# EAGLE schematic interconnect_RSS_V1.0 (EAGLE 9.3.0)
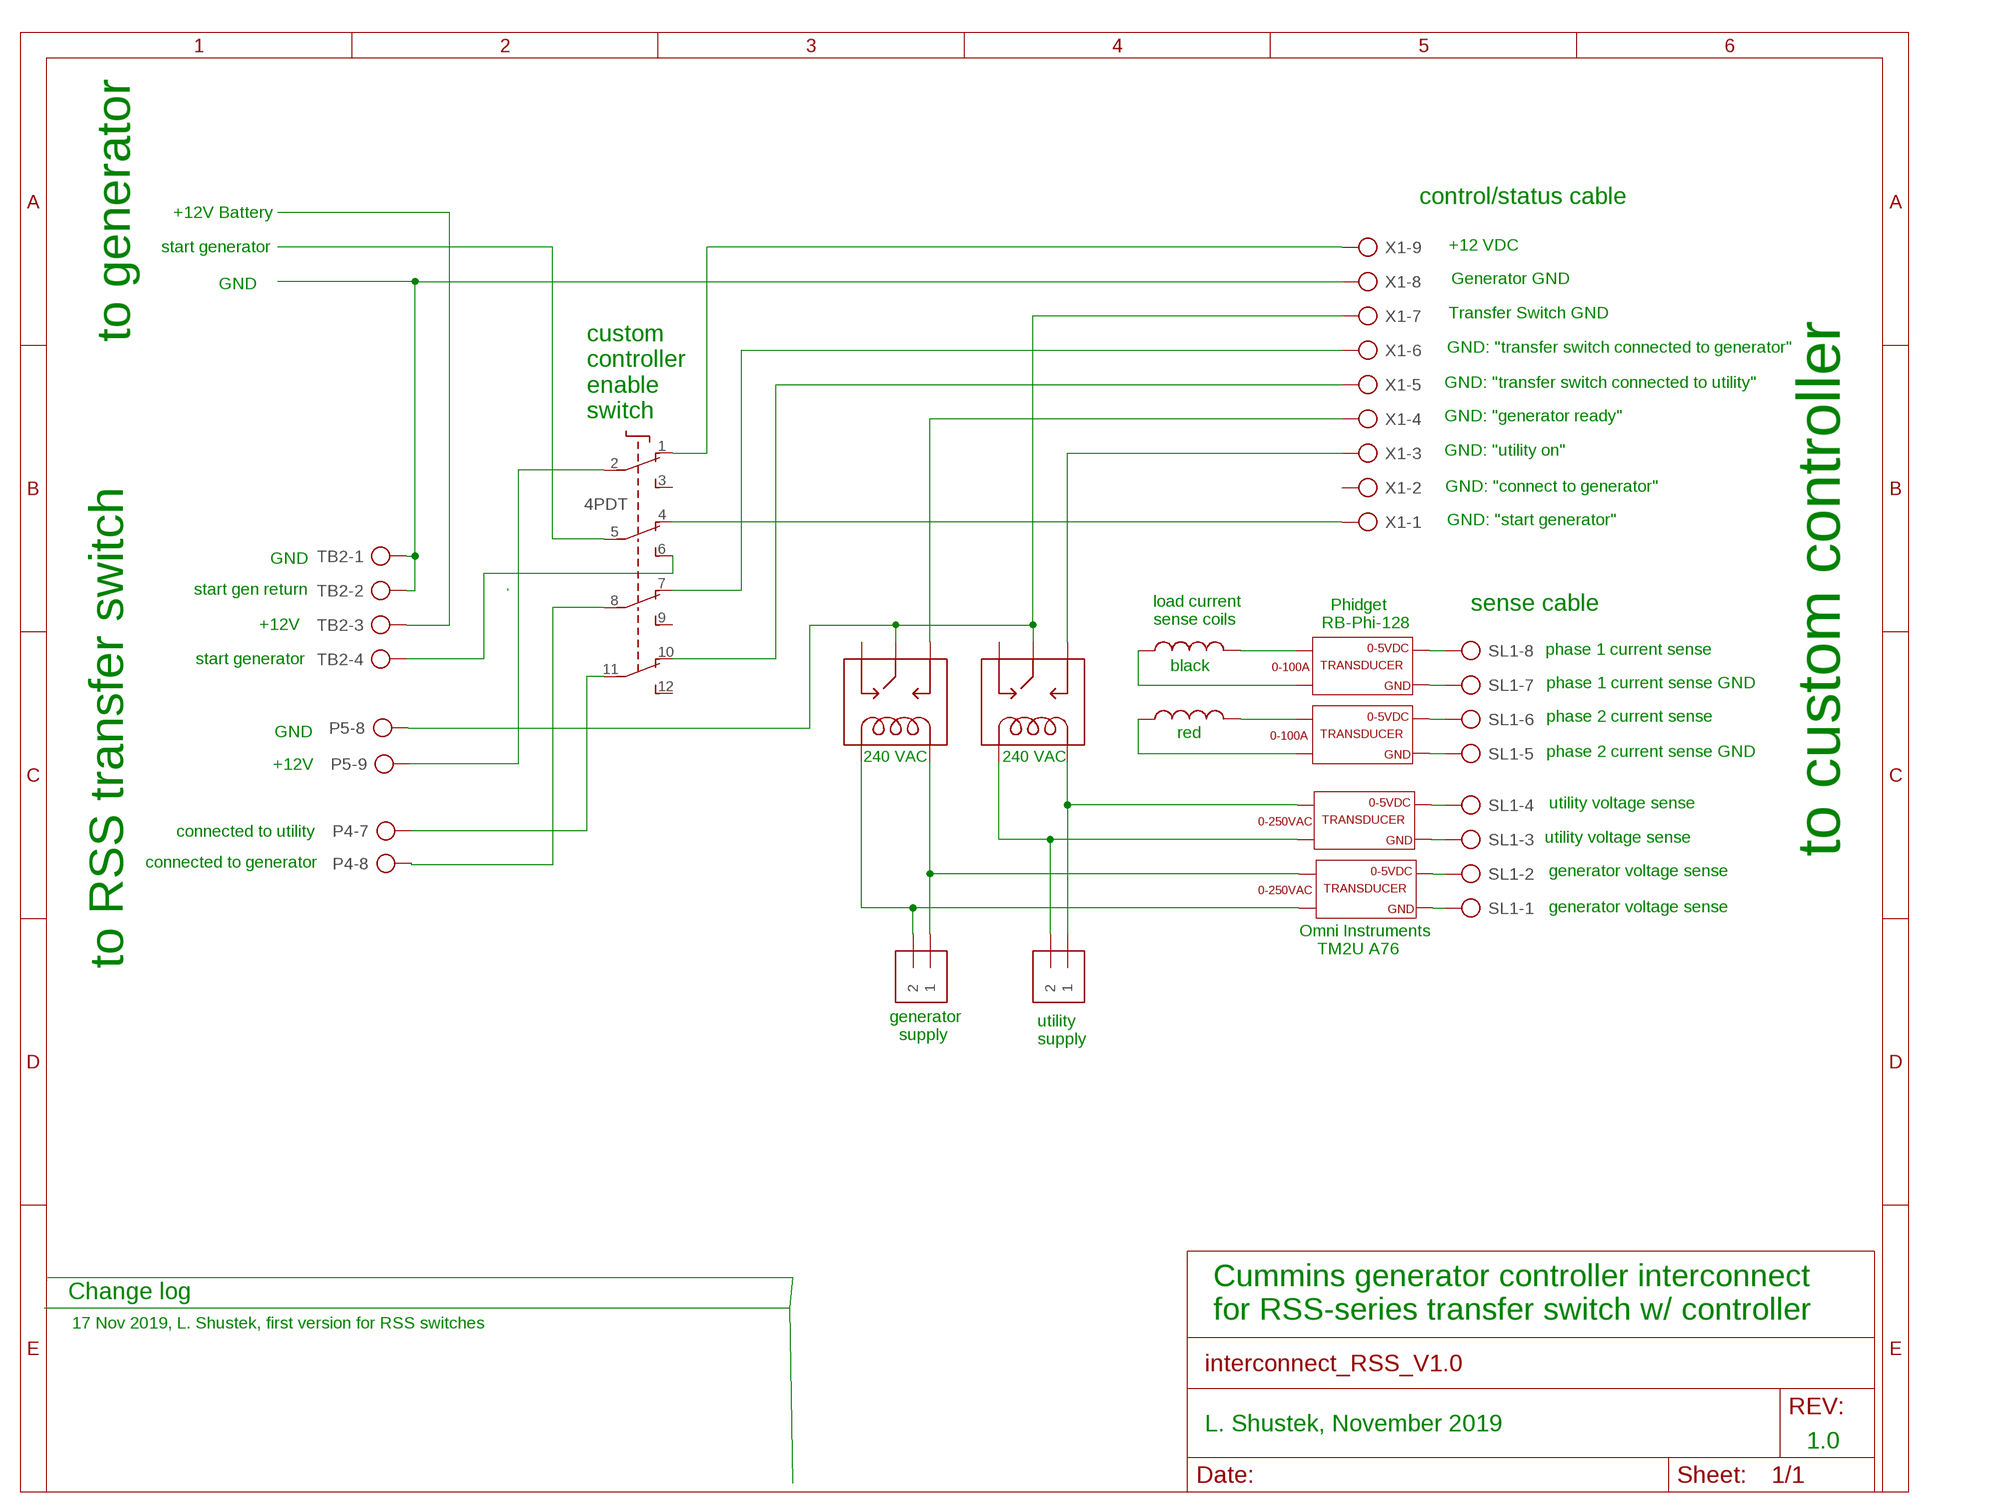
[diagram p0: schematic, sheet 1]

## Parts
J1  1X2-3.5MM  [1X2-3.5MM]
J2  1X2-3.5MM  [1X2-3.5MM]
K1  RELAY-SPDT-V2  [RELAY-PANASONIC-JS]
K2  RELAY-SPDT-V2  [RELAY-PANASONIC-JS]
L1  L-US0204/5  [0204/5]
L2  L-US0204/5  [0204/5]
P4  AK500/10  [AK500/10]
P5  AK500/10  [AK500/10]
S2  4PDT  [4PDT]
SL1  AK500/8  [AK500/8]
TB2  AK500/10  [AK500/10]
U$1  0-100A  TRANSDUCER  [TRANSDUCER]
U$2  0-100A  TRANSDUCER  [TRANSDUCER]
U$3  0-250VAC  TRANSDUCER  [TRANSDUCER]
U$4  0-250VAC  TRANSDUCER  [TRANSDUCER]
X1  AK500/9  [AK500/9]

## Nets
N$1: K1.P$1(MAIN) K2.P$1(MAIN) P5.8 X1.7
N$2: SL1.8 U$1.P$3
N$3: SL1.7 U$1.P$4
N$4: SL1.6 U$2.P$3
N$5: SL1.5 U$2.P$4
N$6: SL1.4 U$3.P$3
N$7: SL1.3 U$3.P$4
N$8: SL1.2 U$4.P$3
N$9: SL1.1 U$4.P$4
N$10: S2.4(O2) X1.1
N$11: J2.1 K2.P$5(COIL2) U$3.P$1
N$12: J2.2 K2.P$2(COIL1) U$3.P$2
N$13: J1.1 K1.P$5(COIL2) U$4.P$1
N$14: J1.2 K1.P$2(COIL1) U$4.P$2
N$15: K2.P$3(NO) X1.3
N$16: K1.P$3(NO) X1.4
N$17: S2.1(O1) X1.9
N$18: S2.10(O4) X1.5
N$19: S2.7(O3) X1.6
N$20: TB2.3
N$21: L1.2 U$1.P$1
N$22: L1.1 U$1.P$2
N$23: L2.1 U$2.P$2
N$24: L2.2 U$2.P$1
N$26: TB2.1 TB2.2 X1.8
N$27: P5.9 S2.2(P1)
N$28: S2.5(P2)
N$29: P4.7 S2.11(P4)
N$31: P4.8 S2.8(P3)
N$32: S2.6(S2) TB2.4
Unconnected: K1.P$4(NC) K2.P$4(NC) P4.1 P4.2 P4.3 P4.4 P4.5 P4.6 P4.9 P4.10 P5.1 P5.2 P5.3 P5.4 P5.5 P5.6 P5.7 P5.10 S2.3(S1) S2.9(S3) S2.12(S4) TB2.5 TB2.6 TB2.7 TB2.8 TB2.9 TB2.10 X1.2

## Notes on the sheet
- control/status cable
- +12V Battery
- start generator | +12 VDC
- Generator GND
- GND
- Transfer Switch GND
- to generator
- GND: "transfer switch connected to generator"
- GND: "transfer switch connected to utility"
- custom
  controller
  enable
  switch
- GND: "generator ready"
- GND: "utility on"
- GND: "connect to generator"
- GND: "start generator"
- GND
- start gen return
- sense cable
- load current
  sense coils
- Phidget
  RB-Phi-128
- +12V
- phase 1 current sense
- start generator
- black
- phase 1 current sense GND
- phase 2 current sense
- GND | red
- phase 2 current sense GND
- 240 VAC | 240 VAC
- +12V
- utility voltage sense
- connected to utility
- utility voltage sense
- to custom controller
- connected to generator
- generator voltage sense
- generator voltage sense
- Omni Instruments
      TM2U A76
- to RSS transfer switch
- generator
    supply
- utility
  supply
- Change log
- Cummins generator controller interconnect
  for RSS-series transfer switch w/ controller
- 17 Nov 2019, L. Shustek, first version for RSS switches
- L. Shustek, November 2019
- 1.0

## Library data of the parts
J1 J2 = adafruit:1X2: 3.5mm Terminal block http://www.ladyada.net/library/pcb/eaglelibrary.html
K1 K2 = Len:RELAY-SPDT-V2: SPDT Electromechanical Relay Single-pole, double-throw sealed relays. When current is applied to the coil, it throws a simple changeover switch, terminating the connection from the NC contact to ground and closing the NO contact. Use them to switch high voltage/high current devices. SparkFun Products JQX-15F: Relay SPDT Sealed - 20A <https://www.sparkfun.com/products/10924> (COM-10924) JZC-11F: Relay SPDT Sealed <https://www.sparkfun.com/products/100> (COM-00100)
L1 L2 = rcl:L-US: INDUCTOR, American symbol; SPICEPREFIX: L
P4 P5 TB2 = con-ptr500:AK500/10: CONNECTOR; OC_FARNELL: unknown; OC_NEWARK: unknown
S2 = Len:4PDT: 3PDT 9 pin footswitch SF17020F-0302-21R-L Source: 3PDT.jpg
SL1 = con-ptr500:AK500/8: CONNECTOR; OC_FARNELL: unknown; OC_NEWARK: unknown
U$1-U$4 = Len:TRANSDUCER
X1 = con-ptr500:AK500/9: CONNECTOR; OC_FARNELL: unknown; OC_NEWARK: unknown